# EAGLE design SPU_Rev_2.1_connectors (EAGLE 9.6.2)
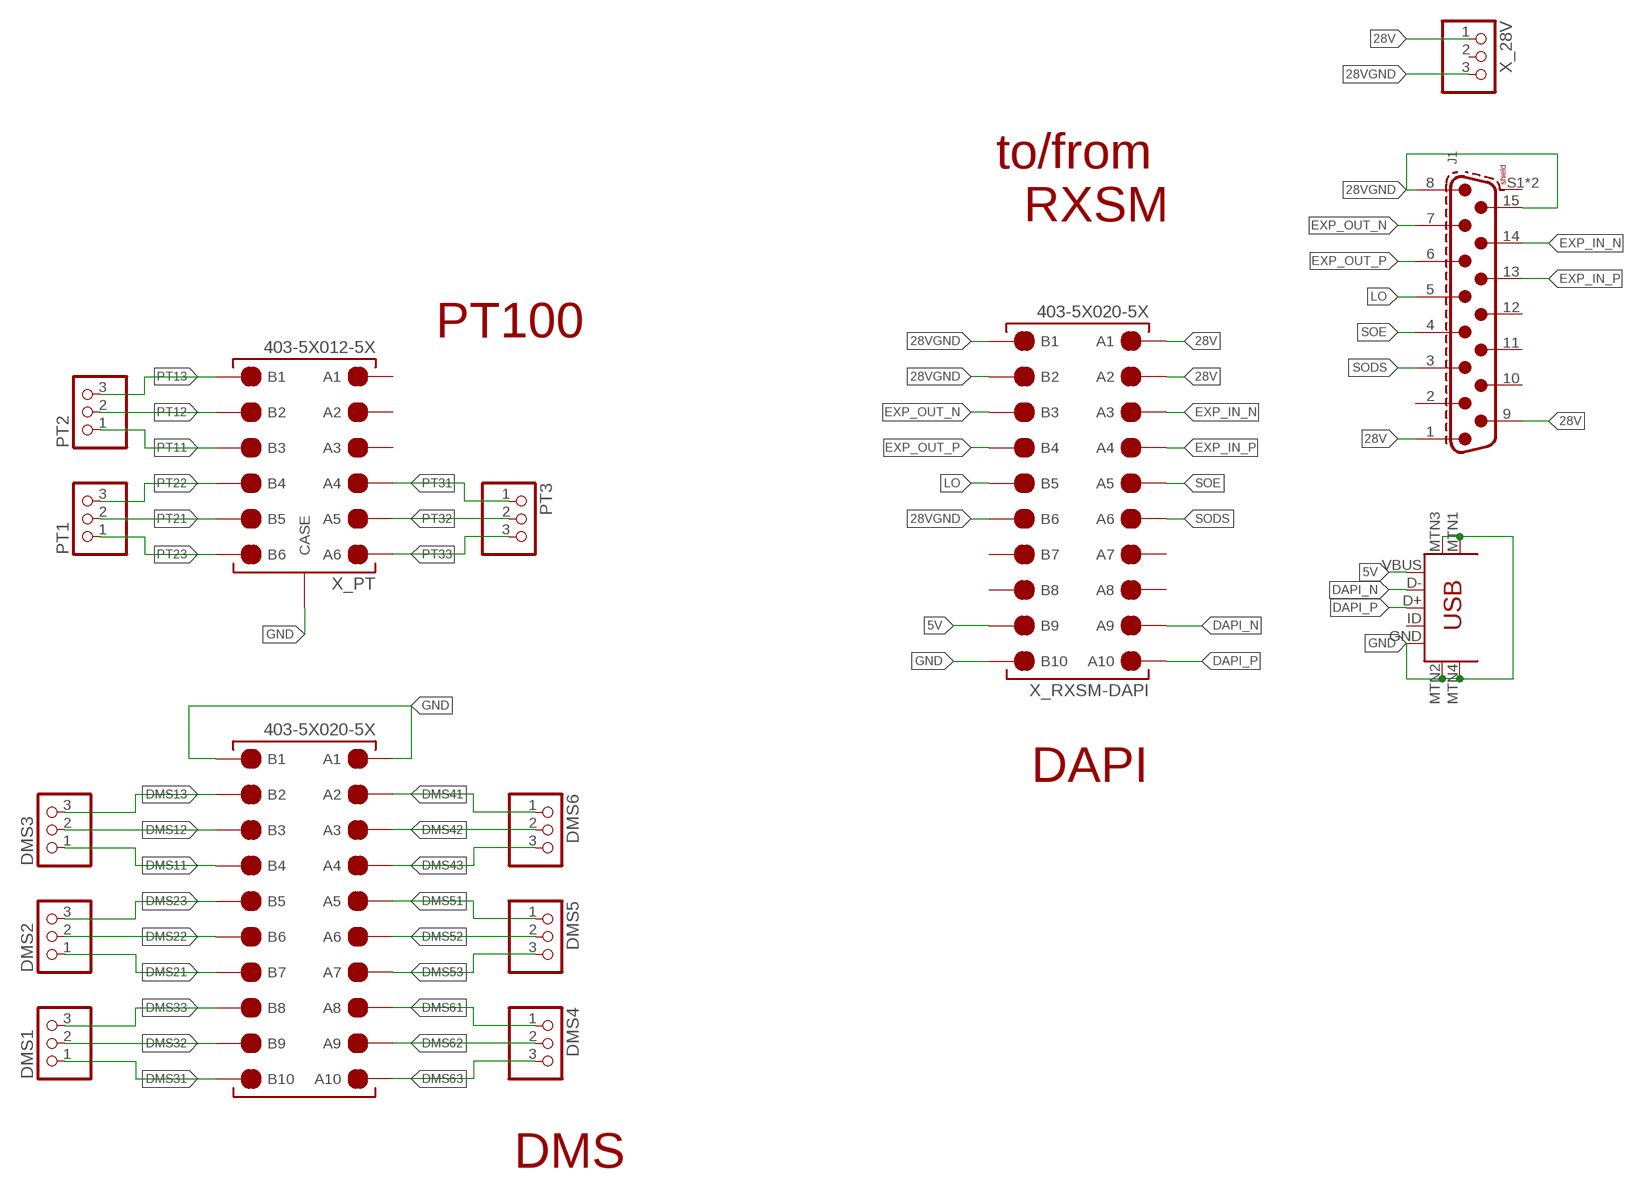
[diagram p0: schematic, sheet 1]

## Parts
DMS1  PINHD-1X3  [1X03]
DMS2  PINHD-1X3  [1X03]
DMS3  PINHD-1X3  [1X03]
DMS4  PINHD-1X3  [1X03]
DMS5  PINHD-1X3  [1X03]
DMS6  PINHD-1X3  [1X03]
J1  6180XX211721_618015211721  [618015211721]
PT1  PINHD-1X3  [1X03]
PT2  PINHD-1X3  [1X03]
PT3  PINHD-1X3  [1X03]
U$1  USB-MINIB-5PIN  [USB-MINIB]
X_28V  PINHD-1X3  [1X03]
X_DMS  403-5X020-5X  [403-5X020-5X]
X_PT  403-5X012-5X  [403-5X012-5X]
X_RXSM-DAPI  403-5X020-5X  [403-5X020-5X]

## Nets
5V: U$1.VBUS X_RXSM-DAPI.P$B9(B9)
28V: J1.1 J1.9 X_28V.1 X_RXSM-DAPI.P$A1(A1) X_RXSM-DAPI.P$A2(A2)
28VGND: J1.8 J1.15 X_28V.3 X_RXSM-DAPI.P$B1(B1) X_RXSM-DAPI.P$B2(B2) X_RXSM-DAPI.P$B6(B6)
DAPI_N: U$1.D- X_RXSM-DAPI.P$A9(A9)
DAPI_P: U$1.D+ X_RXSM-DAPI.P$A10(A10)
DMS11: DMS3.1 X_DMS.P$B4(B4)
DMS12: DMS3.2 X_DMS.P$B3(B3)
DMS13: DMS3.3 X_DMS.P$B2(B2)
DMS21: DMS2.1 X_DMS.P$B7(B7)
DMS22: DMS2.2 X_DMS.P$B6(B6)
DMS23: DMS2.3 X_DMS.P$B5(B5)
DMS31: DMS1.1 X_DMS.P$B10(B10)
DMS32: DMS1.2 X_DMS.P$B9(B9)
DMS33: DMS1.3 X_DMS.P$B8(B8)
DMS41: DMS6.1 X_DMS.P$A2(A2)
DMS42: DMS6.2 X_DMS.P$A3(A3)
DMS43: DMS6.3 X_DMS.P$A4(A4)
DMS51: DMS5.1 X_DMS.P$A5(A5)
DMS52: DMS5.2 X_DMS.P$A6(A6)
DMS53: DMS5.3 X_DMS.P$A7(A7)
DMS61: DMS4.1 X_DMS.P$A8(A8)
DMS62: DMS4.2 X_DMS.P$A9(A9)
DMS63: DMS4.3 X_DMS.P$A10(A10)
EXP_IN_N: J1.14 X_RXSM-DAPI.P$A3(A3)
EXP_IN_P: J1.13 X_RXSM-DAPI.P$A4(A4)
EXP_OUT_N: J1.7 X_RXSM-DAPI.P$B3(B3)
EXP_OUT_P: J1.6 X_RXSM-DAPI.P$B4(B4)
GND: U$1.GND U$1.MTN1(MTN2) U$1.MTN2(MTN3) U$1.MTN3(MTN1) U$1.MTN4 X_DMS.P$A1(A1) X_DMS.P$B1(B1) X_PT.P$BL1(CASE) X_PT.P$BL2(CASE) X_PT.P$BL3(CASE) X_PT.P$BL4(CASE) X_RXSM-DAPI.P$B10(B10)
LO: J1.5 X_RXSM-DAPI.P$B5(B5)
PT11: PT2.1 X_PT.P$B3(B3)
PT12: PT2.2 X_PT.P$B2(B2)
PT13: PT2.3 X_PT.P$B1(B1)
PT21: PT1.2 X_PT.P$B5(B5)
PT22: PT1.3 X_PT.P$B4(B4)
PT23: PT1.1 X_PT.P$B6(B6)
PT31: PT3.1 X_PT.P$A4(A4)
PT32: PT3.2 X_PT.P$A5(A5)
PT33: PT3.3 X_PT.P$A6(A6)
SODS: J1.3 X_RXSM-DAPI.P$A6(A6)
SOE: J1.4 X_RXSM-DAPI.P$A5(A5)
Unconnected: J1.2 J1.10 J1.11 J1.12 J1.S1(SHIELD) J1.S2(SHIELD) U$1.ID X_28V.2 X_PT.P$A1(A1) X_PT.P$A2(A2) X_PT.P$A3(A3) X_RXSM-DAPI.P$A7(A7) X_RXSM-DAPI.P$A8(A8) X_RXSM-DAPI.P$B7(B7) X_RXSM-DAPI.P$B8(B8)

## Notes on the sheet
- to/from
    RXSM
- PT100
- DAPI
- DMS

## Library data of the parts
DMS1-DMS6 PT1-PT3 X_28V = adafruit:PINHD-1X3: PIN HEADER
J1 = Wurth_Connectors_WR-DSUB:6180XX211721_618015211721: WR-DSUB 8.08 mm Male Angled PCB Connector w/o Hex Screw Kind Properties Quality Class:3 as per CECC 75 301-802 Gender:Male Type:Angled Insulator Material:PBT Insulator Flammability Rating:UL94 V-0 Color:Black Contact Material:Copper Alloy Contact Plating:Gold Contact Type:Stamped Shielding Material:Steel Shielding Plating:Nickel General Information Operating Temperature:-55 up to +105 °C Compliance:RoHS Electrical Properties IR1:3 A Working Voltage:125 V (AC) Withstanding Voltage:1000 V (AC) Contact Resistance:30 mΩ <https://www.we-online.com/catalog/media/o33075v209%20Family_WR-DSUB_6180xx211721.jpg> Details see: https://www.we-online.com/catalog/en/DSUB_MALE_ANGLED_PCB_CONNECTOR_W_O_HEX_SCREW_8_08MM_6180XX211721/"https://www.we-online.com/catalog/en/DSUB_MALE_ANGLED_PCB_CONNECTOR_W_O_HEX_SCREW_8_08MM_6180XX211721/ Updated by Yingchun, Shan 2020-01-08 2020 (C) Würth Elektronik; DATASHEET-URL: https://www.we-online.com/catalog/datasheet/618015211721.pdf; GENDER: Male; MATES-WITH: WR-DSUB 10.30 mm Female Angled PCB Connector w. Hex Screw and w/o Hex/ Screw/8.08 mm Female Angled PCB Connector w. Hex Screw and w/o Hex/ Screw/Female IDC/Female PCB Connector w. Hex Screw/Female Solder Bucket; PART-NUMBER: 618015211721; PINS: 15; TYPE: Angled; WE-NUMBER: 618015211721
U$1 = aSparkFun:USB-MINIB: Mini-USB "B" connector with 5th pin broken out. Created new symbol breaking out 5th "ID" pin in mini/micro USB connector spec. See: http://en.wikipedia.org/wiki/Mini_usb#Cables. Uses same footprint as 4-pin symbol. Also added pins to connect to mounting / shield pads if required (probably not generally needed as signals aren't shielded once they leave the connector).
X_DMS X_RXSM-DAPI = con-ept-One27:403-5X020-5X: ept One27 male straight 20pins 1.27 mm pitch SMT Board-to-Board Connector System for parallel, horizontal and perpendicular PCB connections as well as cable-to-board connections. For mezzanine board-to-board connections from 8mm up to 13.8mm. Available with 12 to 80 pins. www.ept.de
X_PT = con-ept-One27:403-5X012-5X: ept One27 male straight 12pins 1.27 mm pitch SMT Board-to-Board Connector System for parallel, horizontal and perpendicular PCB connections as well as cable-to-board connections. For mezzanine board-to-board connections from 8mm up to 13.8mm. Available with 12 to 80 pins. www.ept.de

## Board
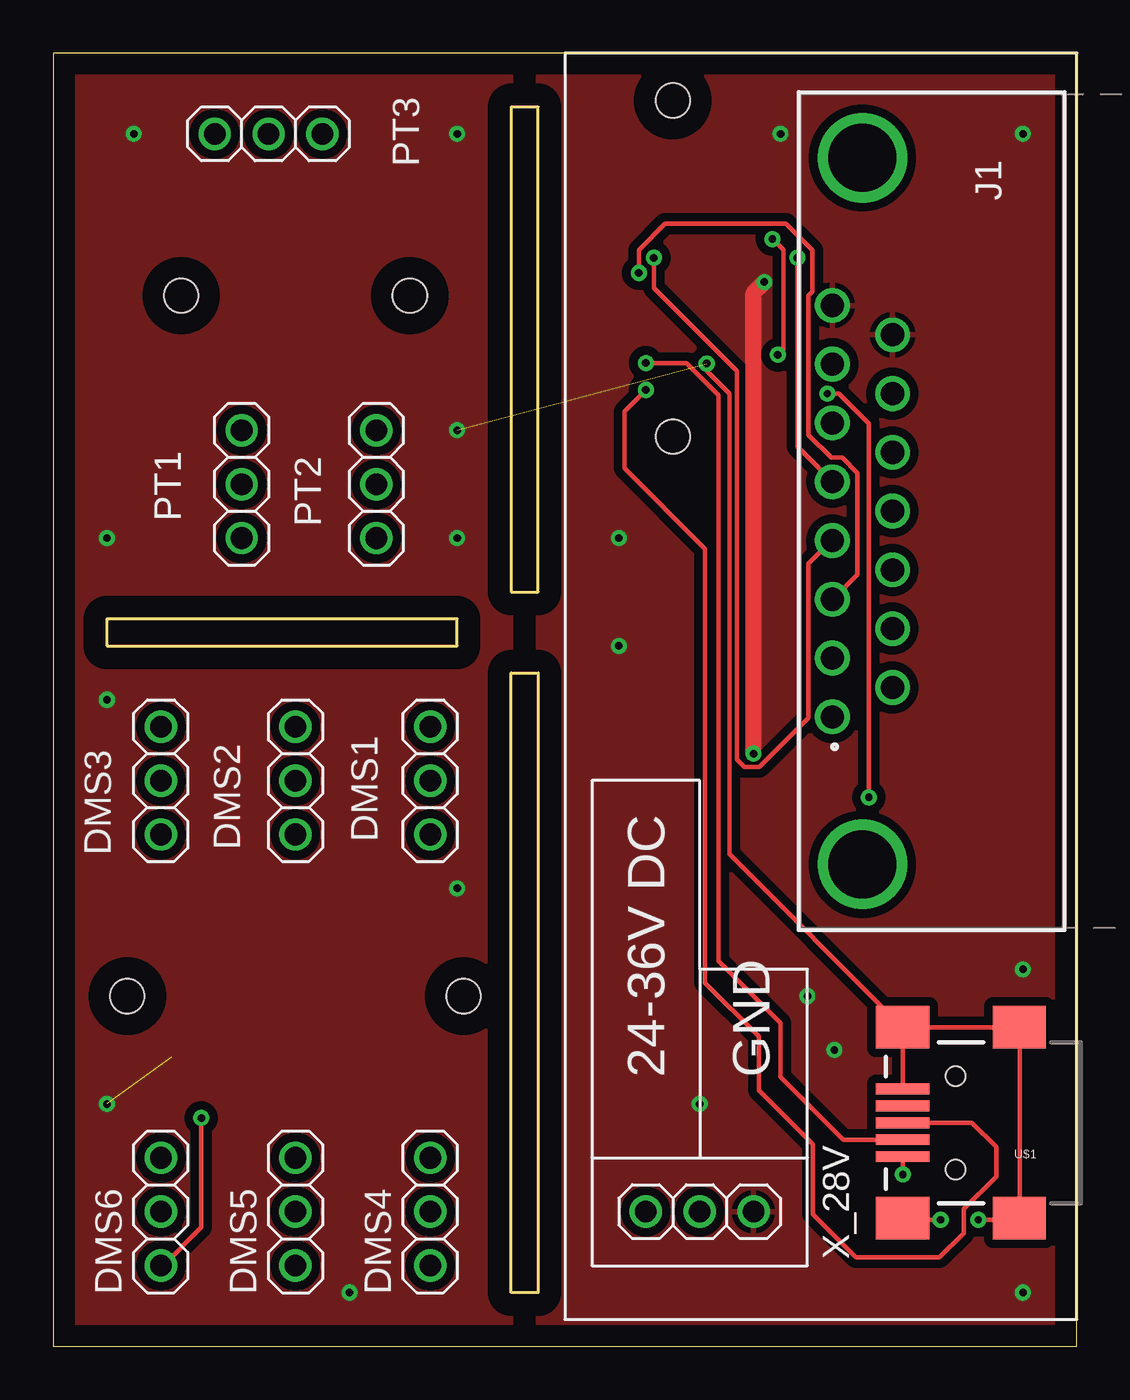
[diagram p1: board, top side]
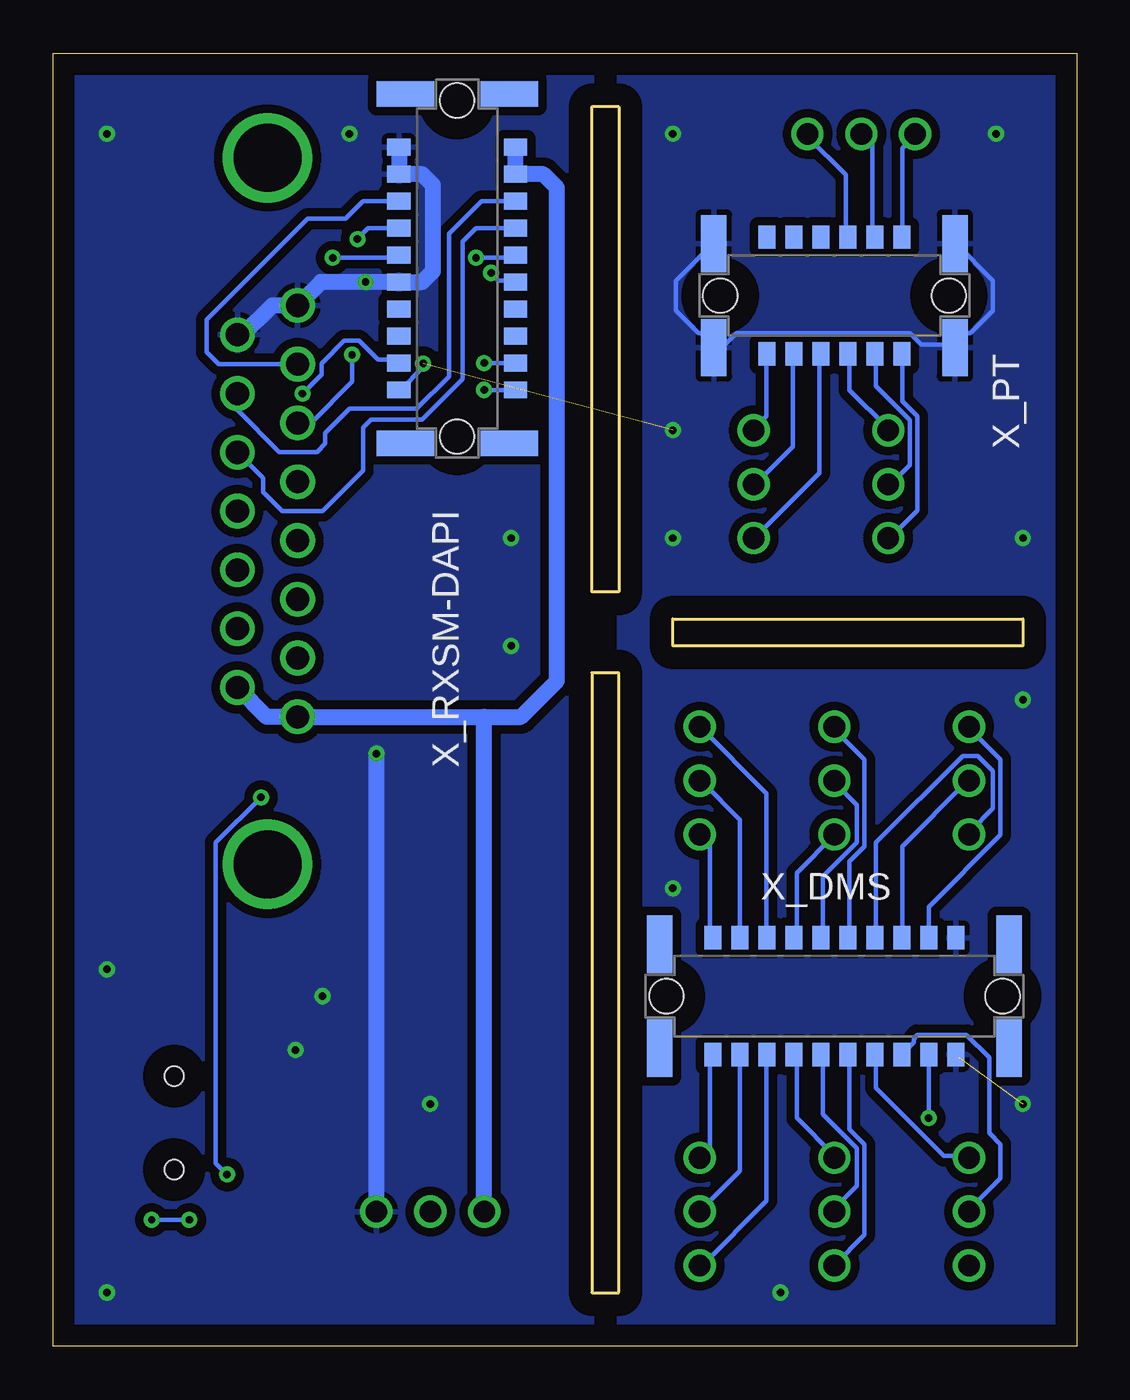
[diagram p2: board, bottom side, seen from below]

Size 48.26 x 60.96 mm. Coordinates in mm from the lower left corner, seen from the top.
Outline: 0,0 48.26,0 48.26,60.96 0,60.96 0,0
Outline: 21.59,58.42 22.86,58.42 22.86,35.56 21.59,35.56 21.59,58.42
Outline: 21.59,31.75 22.86,31.75 22.86,2.54 21.59,2.54 21.59,31.75
Outline: 19.05,34.29 2.54,34.29 2.54,33.02 19.05,33.02 19.05,34.29
Copper layers (1*16): Top 0.035mm / dielectric 1.5mm / Bottom 0.035mm
Design rules "default *": minimum track width 8mil, minimum drill 0.35mm, track to track 6mil, track to pad 6mil, pad to pad 6mil, via to via 6mil, smd to smd 6mil, copper to edge 40mil, drill to drill 6mil, minimum pad ring 10mil, minimum via ring 8mil, stop-mask expansion 4mil, vias tented up to drill 0mil, thermal gap 10mil

### Footprints (pad centres in the part's own frame; a part is rotated, then mirrored left to right if it is on the bottom)
1X03 = drill 1.016: 1 -2.54,0; 2 0,0; 3 2.54,0
618015211721 = drill 1.09: 1 -9.695,7.72; 2 -6.925,7.72; 3 -4.155,7.72; 4 -1.385,7.72; 5 1.385,7.72; 6 4.155,7.72; 7 6.925,7.72; 8 9.695,7.72; 9 -8.31,4.88; 10 -5.54,4.88; 11 -2.77,4.88; 12 0,4.88; 13 2.77,4.88; 14 5.54,4.88; 15 8.31,4.88 | drill 3.2: S1 -16.65,6.3; S2 16.65,6.3
USB-MINIB = smd 2.5 x 0.5: D+ 2.5,0; D- 2.5,0.8; GND 2.5,-1.6; ID 2.5,-0.8; VBUS 2.5,1.6 | smd 2.5 x 2: MTN1 -3,4.5; MTN2 2.5,4.5; MTN3 -3,-4.5; MTN4 2.5,-4.5 | hole 0.9: 0,2.2; 0,-2.2
403-5X020-5X = smd 0.8 x 1.1: P$A1 5.715,-2.75; P$A2 4.445,-2.75; P$A3 3.175,-2.75; P$A4 1.905,-2.75; P$A5 0.635,-2.75; P$A6 -0.635,-2.75; P$A7 -1.905,-2.75; P$A8 -3.175,-2.75; P$A9 -4.445,-2.75; P$A10 -5.715,-2.75; P$B1 5.715,2.75; P$B2 4.445,2.75; P$B3 3.175,2.75; P$B4 1.905,2.75; P$B5 0.635,2.75; P$B6 -0.635,2.75; P$B7 -1.905,2.75; P$B8 -3.175,2.75; P$B9 -4.445,2.75; P$B10 -5.715,2.75 | smd 1.2 x 2.7: P$BL1 -8.225,2.45; P$BL2 8.225,2.45; P$BL3 -8.225,-2.45; P$BL4 8.225,-2.45 | hole 1.6: -7.925,0; 7.925,0
403-5X012-5X = smd 0.8 x 1.1: P$A1 3.175,-2.75; P$A2 1.905,-2.75; P$A3 0.635,-2.75; P$A4 -0.635,-2.75; P$A5 -1.905,-2.75; P$A6 -3.175,-2.75; P$B1 3.175,2.75; P$B2 1.905,2.75; P$B3 0.635,2.75; P$B4 -0.635,2.75; P$B5 -1.905,2.75; P$B6 -3.175,2.75 | smd 1.2 x 2.7: P$BL1 -5.685,2.45; P$BL2 5.685,2.45; P$BL3 -5.685,-2.45; P$BL4 5.685,-2.45 | hole 1.6: -5.385,0; 5.385,0

### Placement (x,y rotation side)
DMS1  17.78,26.67 90 top
DMS2  11.43,26.67 90 top
DMS3  5.08,26.67 90 top
DMS4  17.78,6.35 90 top
DMS5  11.43,6.35 90 top
DMS6  5.08,6.35 90 top
J1  44.45,39.37 90 top
PT1  8.89,40.64 90 top
PT2  15.24,40.64 90 top
PT3  10.16,57.15 180 top
U$1  42.55,10.54 180 top
X_28V  30.48,6.35 0 top
X_DMS  11.43,16.51 0 bottom
X_PT  11.43,49.53 180 bottom
X_RXSM-DAPI  29.21,50.8 90 bottom

### Tracks (layer width: path | path; a pad name or v marks a point on that pad's centre or on a via)
5V  (via drill 0.35)
  Top 0.203: v36.5,44.91 37.03,44.91 38.46,43.48 v38.46,25.88 | v40.06,8.1 40.06,8.81 U$1.VBUS
  Bottom 0.203: v36.5,44.91 35.61,45.8 35.61,46.33 34.54,47.4 33.83,47.4 32.94,46.51 32.05,46.51 X_RXSM-DAPI.P$B9 | v38.46,25.88 40.59,23.75 40.59,8.64 v40.06,8.1
28V
  Bottom 0.762: J1.9 38.19,29.68 J1.1 27.94,29.68 | 27.94,29.68 26.2,29.68 24.51,31.37 24.51,54.61 25.15,55.24 X_RXSM-DAPI.P$A2 X_RXSM-DAPI.P$A1 | X_28V.1 27.94,29.68
28VGND  (via drill 0.35)
  Top 0.762: v33.53,50.16 33.02,49.66 v33.02,27.94
  Bottom 0.762: J1.15 39.31,47.68 37.93,49.06 J1.8 35.63,50.16 v33.53,50.16 X_RXSM-DAPI.P$B6 30.86,50.16 30.35,50.67 30.35,54.74 30.86,55.24 X_RXSM-DAPI.P$B2 X_RXSM-DAPI.P$B1 | X_28V.3 v33.02,27.94
  other vias: 36.83,13.97 35.56,16.51 45.72,17.78 30.48,11.43 45.72,2.54 26.67,33.02 26.67,38.1 34.29,57.15 45.72,57.15
  pour Top (isolate 0.406): 22.86,-1.27 22.86,62.23 29.21,62.23 49.53,62.23 49.53,54.61 49.53,-1.27
  pour Bottom (isolate 0.406): 49.53,-1.27 49.53,62.23 43.18,62.23 22.86,62.23 22.86,54.61 22.86,-1.27
DAPI_N  (via drill 0.35)
  Top 0.203: v27.94,46.35 29.84,46.35 31.37,44.83 31.37,18.16 34.29,15.24 34.29,12.7 37.25,9.74 U$1.D-
  Bottom 0.203: X_RXSM-DAPI.P$A9 v27.94,46.35
DAPI_P  (via drill 0.35)
  Top 0.203: v27.94,45.09 26.92,44.07 26.92,41.4 30.73,37.59 30.73,17.14 33.27,14.6 33.27,12.06 35.81,9.53 35.81,6.22 37.85,4.19 41.78,4.19 42.93,5.33 42.93,6.48 44.45,8 44.45,9.4 43.31,10.54 U$1.D+
  Bottom 0.203: X_RXSM-DAPI.P$A10 v27.94,45.09
DMS11
  Bottom 0.203: X_DMS.P$B4 9.47,19.3 9.47,23.75 5.38,27.84 4.67,27.84 3.96,27.13 3.96,25.35 5.03,24.28 DMS3.1
DMS12
  Bottom 0.203: X_DMS.P$B3 8.23,19.3 8.23,23.57 5.21,26.59 DMS3.2
DMS13
  Bottom 0.203: X_DMS.P$B2 6.98,20.73 3.61,24.11 3.61,27.66 5.03,29.08 DMS3.3
DMS21
  Bottom 0.203: X_DMS.P$B7 13.21,19.3 13.21,22.33 11.43,24.11 DMS2.1
DMS22
  Bottom 0.203: X_DMS.P$B6 11.96,19.3 11.96,22.15 10.36,23.75 10.36,25.53 11.43,26.59 DMS2.2
DMS23
  Bottom 0.203: X_DMS.P$B5 10.72,19.3 10.72,22.86 10.01,23.57 10.01,27.66 11.43,29.08 DMS2.3
DMS31
  Bottom 0.203: X_DMS.P$B10 17.3,19.3 17.3,23.75 17.65,24.11 DMS1.1
DMS32
  Bottom 0.203: X_DMS.P$B9 15.88,24.82 17.65,26.59 DMS1.2
DMS33
  Bottom 0.203: DMS1.3 14.63,26.06 14.63,19.3 X_DMS.P$B8
DMS41  (via drill 0.35)
  Top 0.203: v6.98,10.77 6.98,5.61 5.21,3.83 DMS6.1
  Bottom 0.203: v6.98,10.77 X_DMS.P$A2
DMS42
  Bottom 0.203: X_DMS.P$A3 8.23,13.79 7.7,14.33 7.7,14.5 7.52,14.68 5.21,14.68 4.14,13.61 4.14,10.06 3.61,9.53 3.61,7.92 5.03,6.5 DMS6.2
DMS43
  Bottom 0.203: X_DMS.P$A4 9.47,13.61 9.47,12.19 6.27,8.99 5.21,8.99 DMS6.3
DMS51
  Bottom 0.203: X_DMS.P$A5 10.72,13.61 10.72,10.24 10.01,9.53 10.01,5.26 11.43,3.83 DMS5.1
DMS52
  Bottom 0.203: X_DMS.P$A6 11.96,13.61 11.96,10.95 10.36,9.35 10.36,7.57 11.43,6.5 DMS5.2
DMS53
  Bottom 0.203: X_DMS.P$A7 13.21,13.61 13.21,10.77 11.43,8.99 DMS5.3
DMS61
  Bottom 0.203: X_DMS.P$A8 14.63,13.61 14.63,6.86 17.65,3.83 DMS4.1
DMS62
  Bottom 0.203: X_DMS.P$A9 15.88,8.28 17.65,6.5 DMS4.2
DMS63
  Bottom 0.203: X_DMS.P$A10 17.3,13.61 17.3,9.35 17.65,8.99 DMS4.3
EXP_IN_N
  Bottom 0.203: X_RXSM-DAPI.P$A3 28.07,53.97 29.59,52.45 29.59,45.72 31.11,44.2 34.29,44.2 35.43,43.05 35.43,42.54 35.81,42.16 37.59,42.16 39.57,44.14 J1.14
EXP_IN_P
  Bottom 0.203: X_RXSM-DAPI.P$A4 28.32,52.7 28.96,52.07 28.96,45.59 30.86,43.69 33.27,43.69 33.66,43.31 33.66,41.27 35.56,39.37 37.47,39.37 38.35,40.26 38.35,40.92 J1.13
EXP_OUT_N
  Bottom 0.203: X_RXSM-DAPI.P$B3 33.66,53.97 34.48,53.15 36.26,53.15 41.02,48.39 41.02,46.86 40.45,46.29 J1.7
EXP_OUT_P  (via drill 0.35)
  Top 0.203: v33.91,52.2 34.42,51.69 34.42,46.99 v34.16,46.74
  Bottom 0.203: X_RXSM-DAPI.P$B4 33.4,52.7 v33.91,52.2 | v34.16,46.74 34.16,45.47 36.1,43.52 J1.6
GND  (via drill 0.35)  (2 unrouted)
  Top 0.203: v41.83,5.97 40.06,5.97 U$1.MTN2 | v43.61,5.97 45.39,5.97 U$1.MTN1 45.57,6.15 45.57,15.04 U$1.MTN3 45.39,15.04 40.06,15.04 | v30.81,46.33 30.81,45.97 31.88,44.91 31.88,23.22 39.88,15.21 U$1.MTN4 40.06,15.04 | 40.06,15.04 40.06,12.19 U$1.GND
  Bottom 0.203: v43.61,5.97 v41.83,5.97 | v30.81,46.33 30.81,46.15 31.88,45.09 X_RXSM-DAPI.P$B10 | 5.56,13.61 X_DMS.P$A1 | 5.56,19.3 X_DMS.P$B1 | X_PT.P$BL1 5.74,47.22 5.21,47.75 5.03,47.75 3.96,48.82 3.96,50.24 5.74,52.02 X_PT.P$BL3 | X_PT.P$BL4 17.12,52.02 18.9,50.24 18.9,48.82 17.83,47.75 17.65,47.75 17.12,47.22 X_PT.P$BL2 16.94,47.22 16.59,47.22 16.05,47.75 7.87,47.75 7.34,47.22 5.92,47.22 X_PT.P$BL1 | 5.74,47.04 X_PT.P$BL1
  other vias: 3.81,57.15 2.54,38.1 19.05,38.1 19.05,43.18 19.05,57.15 2.54,30.48 19.05,21.59 2.54,11.43 13.97,2.54
  pour Bottom (isolate 0.406): -1.27,62.23 21.59,62.23 21.59,52.07 21.59,-1.27 -1.27,-1.27
  pour Top (isolate 0.406): 21.59,62.23 -1.27,62.23 -1.27,52.07 -1.27,-1.27 21.59,-1.27
LO  (via drill 0.35)
  Top 0.203: v35.08,51.31 35.08,42.42 36.68,40.82 J1.5
  Bottom 0.203: v35.08,51.31 32.05,51.31 X_RXSM-DAPI.P$B5
PT11
  Bottom 0.203: X_PT.P$B3 12.14,46.68 12.14,41.17 15.16,38.15 PT2.1
PT12
  Bottom 0.203: X_PT.P$B2 13.39,46.68 13.39,42.42 15.16,40.64 PT2.2
PT13
  Bottom 0.203: X_PT.P$B1 14.63,46.68 14.63,43.84 15.16,43.31 PT2.3
PT21
  Bottom 0.203: X_PT.P$B5 9.47,46.68 9.47,45.26 7.87,43.66 7.87,41.53 8.76,40.64 PT1.2
PT22
  Bottom 0.203: X_PT.P$B4 10.72,46.68 10.72,45.09 8.94,43.31 PT1.3
PT23
  Bottom 0.203: X_PT.P$B6 8.23,46.68 8.23,44.55 7.52,43.84 7.52,39.39 8.76,38.15 PT1.1
PT31
  Bottom 0.203: X_PT.P$A4 10.9,52.38 10.9,55.22 12.68,57 PT3.1
PT32
  Bottom 0.203: PT3.2 9.65,56.64 9.65,52.38 X_PT.P$A5
PT33
  Bottom 0.203: X_PT.P$A6 8.23,52.38 8.23,56.46 7.7,57 PT3.3
SODS  (via drill 0.35)
  Top 0.203: v27.61,50.6 27.61,51.66 28.85,52.91 34.54,52.91 35.79,51.66 35.79,49.71 35.61,49.53 35.61,42.95 36.68,41.88 37.21,41.88 37.92,41.17 37.92,36.37 36.86,35.31 J1.3
  Bottom 0.203: v27.61,50.6 27.25,50.24 26.54,50.24 X_RXSM-DAPI.P$A6
SOE  (via drill 0.35)
  Top 0.203: v28.32,51.31 28.32,49.89 32.23,45.97 32.23,27.66 32.59,27.3 33.3,27.3 35.61,29.62 35.61,36.91 36.68,37.97 J1.4
  Bottom 0.203: v28.32,51.31 26.54,51.31 X_RXSM-DAPI.P$A5

### Text on the board
tNames: 24-36V DC | GND